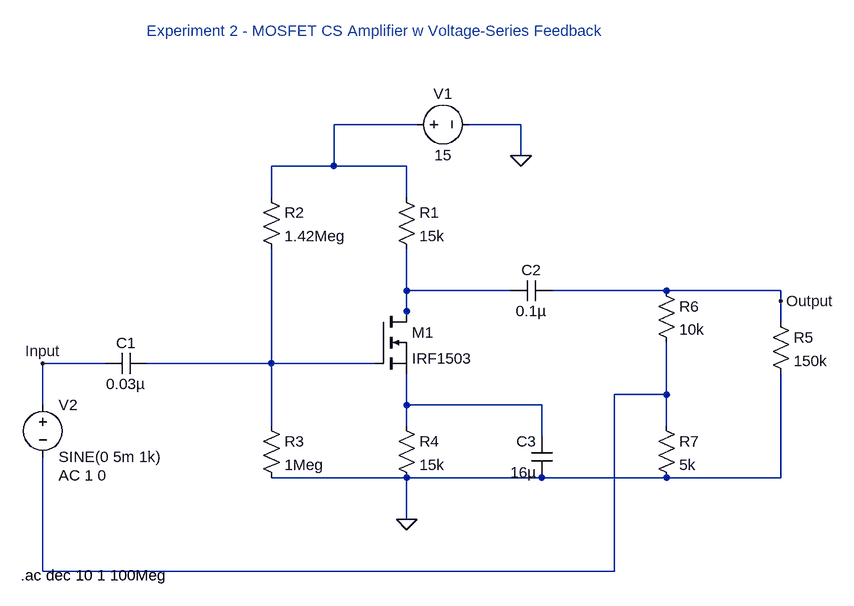
[diagram p0: schematic Experiment 2 - MOSFET CS Amplifier w Voltage-Series Feedback.asc]
Experiment 2 - MOSFET CS Amplifier w Voltage-Series Feedback.asc, the LTspice schematic file:
Version 4
SHEET 1 880 872
WIRE -704 160 -832 160
WIRE -544 160 -624 160
WIRE -544 208 -544 160
WIRE -832 224 -832 160
WIRE -832 224 -928 224
WIRE -720 224 -832 224
WIRE -928 272 -928 224
WIRE -720 272 -720 224
WIRE -720 416 -720 352
WIRE -560 416 -720 416
WIRE -320 416 -496 416
WIRE -144 416 -320 416
WIRE -144 432 -144 416
WIRE -720 448 -720 416
WIRE -720 464 -720 448
WIRE -144 464 -144 432
WIRE -1184 528 -1280 528
WIRE -928 528 -928 352
WIRE -928 528 -1120 528
WIRE -768 528 -928 528
WIRE -320 576 -320 496
WIRE -320 576 -400 576
WIRE -1280 592 -1280 528
WIRE -720 592 -720 544
WIRE -512 592 -720 592
WIRE -928 624 -928 528
WIRE -720 624 -720 592
WIRE -320 624 -320 576
WIRE -512 640 -512 592
WIRE -720 704 -928 704
WIRE -512 704 -720 704
WIRE -320 704 -512 704
WIRE -144 704 -144 544
WIRE -144 704 -320 704
WIRE -720 768 -720 704
WIRE -1280 848 -1280 672
WIRE -400 848 -400 576
WIRE -400 848 -1280 848
FLAG -720 768 0
FLAG -544 208 0
FLAG -144 432 Output
FLAG -1280 528 Input
SYMBOL nmos -768 448 R0
SYMATTR InstName M1
SYMATTR Value IRF1503
SYMBOL res -736 256 R0
SYMATTR InstName R1
SYMATTR Value 15k
SYMBOL res -944 256 R0
SYMATTR InstName R2
SYMATTR Value 1.42Meg
SYMBOL res -944 608 R0
SYMATTR InstName R3
SYMATTR Value 1Meg
SYMBOL res -736 608 R0
SYMATTR InstName R4
SYMATTR Value 15k
SYMBOL res -160 448 R0
SYMATTR InstName R5
SYMATTR Value 150k
SYMBOL res -336 400 R0
SYMATTR InstName R6
SYMATTR Value 10k
SYMBOL res -336 608 R0
SYMATTR InstName R7
SYMATTR Value 5k
SYMBOL cap -1120 512 R90
WINDOW 0 0 32 VBottom 2
WINDOW 3 32 32 VTop 2
SYMATTR InstName C1
SYMATTR Value 0.03µ
SYMBOL cap -496 400 R90
WINDOW 0 0 32 VBottom 2
WINDOW 3 32 32 VTop 2
SYMATTR InstName C2
SYMATTR Value 0.1µ
SYMBOL cap -496 704 R180
WINDOW 0 24 56 Left 2
WINDOW 3 24 8 Left 2
SYMATTR InstName C3
SYMATTR Value 16µ
SYMBOL voltage -720 160 R270
WINDOW 0 32 56 VTop 2
WINDOW 3 -32 56 VBottom 2
WINDOW 123 0 0 Left 0
WINDOW 39 0 0 Left 0
SYMATTR InstName V1
SYMATTR Value 15
SYMBOL voltage -1280 576 R0
WINDOW 123 24 124 Left 2
WINDOW 39 0 0 Left 0
SYMATTR Value2 AC 1 0
SYMATTR InstName V2
SYMATTR Value SINE(0 5m 1k)
TEXT -1120 16 Left 2 ;Experiment 2 - MOSFET CS Amplifier w Voltage-Series Feedback
TEXT -1314 854 Left 2 !.ac dec 10 1 100Meg

The netlist it stands for:
* Experiment 2 - MOSFET CS Amplifier w Voltage-Series Feedback.asc
M1 N002 N003 N005 N005 IRF1503
R1 N001 N002 15k
R2 N001 N003 1.42Meg
R3 N003 0 1Meg
R4 N005 0 15k
R5 Output 0 150k
R6 Output N004 10k
R7 N004 0 5k
C1 N003 Input 0.03µ
C2 Output N002 0.1µ
C3 0 N005 16µ
V1 N001 0 15
V2 Input N004 SINE(0 5m 1k) AC 1 0
.model NMOS NMOS
.model PMOS PMOS
.lib standard.mos
* Experiment 2 - MOSFET CS Amplifier w Voltage-Series Feedback
.ac dec 10 1 100Meg
.backanno
.end